# EAGLE design PenMega (EAGLE 6.5.0)
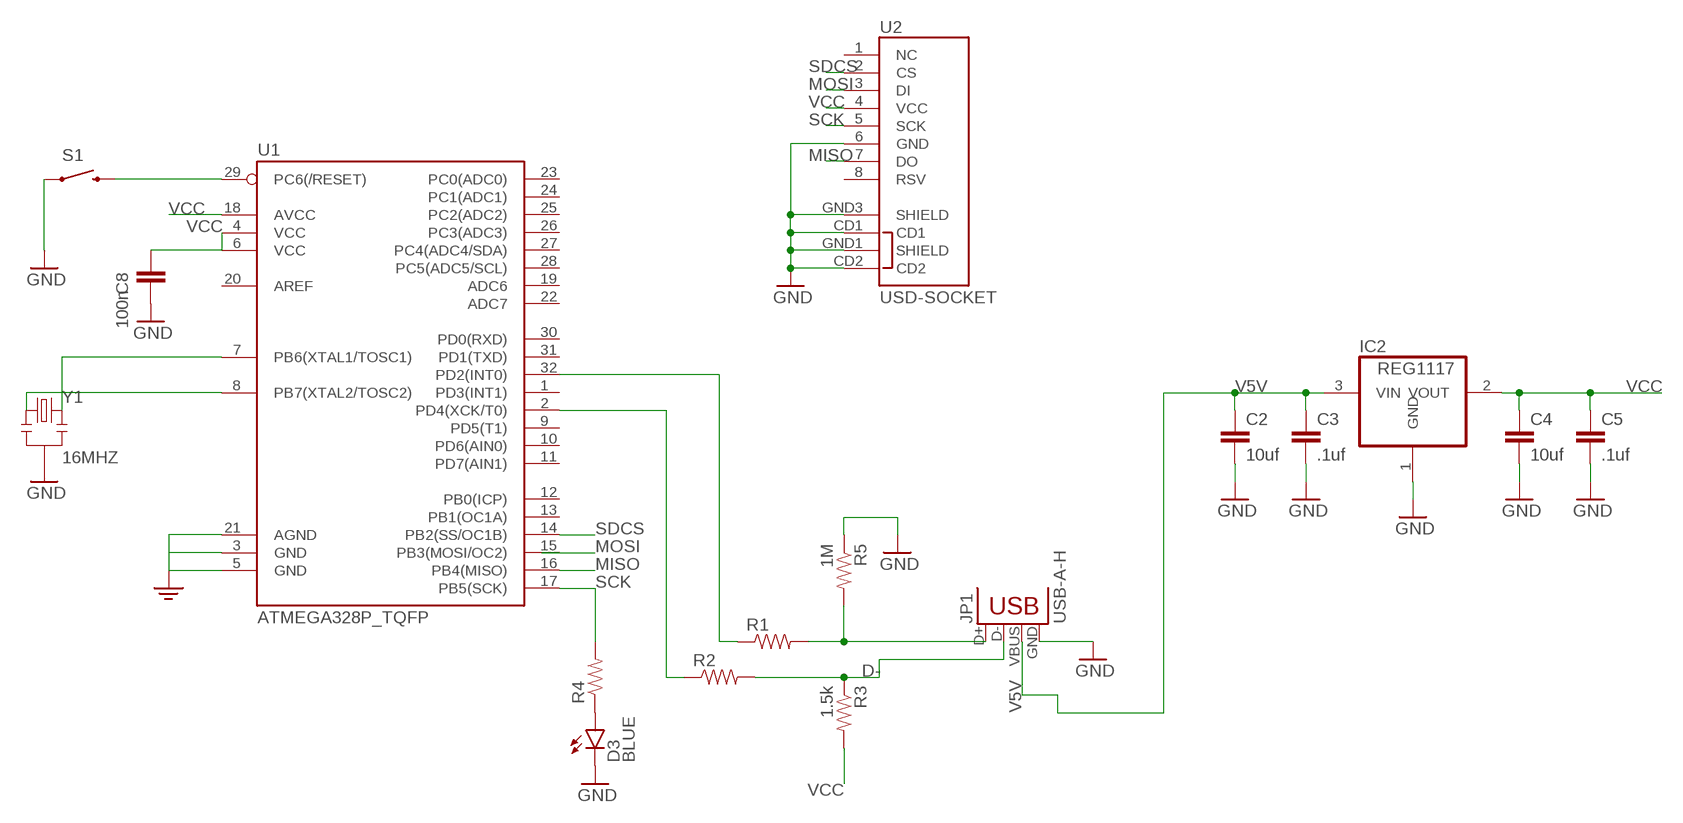
[diagram p0: schematic, sheet 1]

## Parts
C2  10uf  22UF-6.3V-20%(0805)  [0805]
C3  .1uf  CAP0603-CAP  [0603-CAP]
C4  10uf  22UF-6.3V-20%(0805)  [0805]
C5  .1uf  CAP0603-CAP  [0603-CAP]
C8  100n  CAP0603-CAP  [0603-CAP]
D3  BLUE  LED-BLUE0603  [LED-0603]
IC2  REG1117  [SOT223]
JP1  USB-A-H  [USB-A-H]
R1  RESISTOR0603-RES  [0603-RES]
R2  RESISTOR0603-RES  [0603-RES]
R3  1.5k  RESISTOR0603-RES  [0603-RES]
R4  RESISTOR0603-RES  [0603-RES]
R5  1M  RESISTOR0603-RES  [0603-RES]
S1  SWITCH-MOMENTARY-2SMD  [TACTILE-SWITCH-SMD]
U1  ATMEGA328P_TQFP  [TQFP32-08]
U2  USD-SOCKET  [MICROSD_1:1]
Y1  16MHZ  RESONATOR16MHZ  [RESONATOR-SMD]

## Nets
D-: JP1.D- R2.2 R3.1
GND: C2.2 C3.2 C4.2 C5.2 C8.2 D3.C IC2.1(GND) JP1.GND R5.1 S1.1 U1.3(GND) U1.5(GND) U1.21(AGND) U2.6(GND) U2.CD1 U2.CD2 U2.GND1(SHIELD) U2.GND3(SHIELD) Y1.2 ; supply symbol labelled GND2
MISO: U1.16(PB4(MISO)) U2.7(DO)
MOSI: U2.3(DI)
N$1: U1.8(PB7(XTAL2/TOSC2)) Y1.1
N$2: U1.7(PB6(XTAL1/TOSC1)) Y1.3
N$3: JP1.D+ R1.2 R5.2
N$5: R2.1 U1.2(PD4(XCK/T0))
N$6: R1.1 U1.32(PD2(INT0))
N$7: S1.3 U1.29(PC6(/RESET))
N$12: D3.A R4.1
SCK: R4.2 U1.17(PB5(SCK)) U2.5(SCK)
SDCS: U1.14(PB2(SS/OC1B)) U2.2(CS)
V5V: C2.1 C3.1 IC2.3(VIN) JP1.VBUS
VCC: C4.1 C5.1 C8.1 IC2.2(VOUT) R3.2 U1.4(VCC) U1.6(VCC) U1.18(AVCC) U2.4(VCC)
Unconnected: U1.1(PD3(INT1)) U1.9(PD5(T1)) U1.10(PD6(AIN0)) U1.11(PD7(AIN1)) U1.12(PB0(ICP)) U1.13(PB1(OC1A)) U1.15(PB3(MOSI/OC2)) U1.19(ADC6) U1.20(AREF) U1.22(ADC7) U1.23(PC0(ADC0)) U1.24(PC1(ADC1)) U1.25(PC2(ADC2)) U1.26(PC3(ADC3)) U1.27(PC4(ADC4/SDA)) U1.28(PC5(ADC5/SCL)) U1.30(PD0(RXD)) U1.31(PD1(TXD)) U2.1(NC) U2.8(RSV)

## Library data of the parts
C2 C4 = SparkFun-Capacitors:22UF-6.3V-20%(0805): CAP-08402 Ceramic; PROD_ID: CAP-08402; VALUE: 22uF
C3 C5 C8 = SparkFun-Passives:CAP: Capacitor Standard 0603 ceramic capacitor, and 0.1" leaded capacitor.
D3 = SparkFun-LED:LED-BLUE: Blue LEDs for production use Various blue LEDs stocked by SparkFun production 0603 - DIO-08575 Rebel - DIO-09553 1206 - DIO-09911; PROD_ID: DIO-08575
IC2 = burr-brown:REG1117: 800mA and 1A Low Dropout (LDO) Positive Regulator 1.8V, 2.5V, 2.85V, 3.3V, 5V, and Adj; MPN: REG1117; OC_FARNELL: 1097566; OC_NEWARK: 14P6981
JP1 = SparkFun-Connectors:USB: USB Connectors USB-B-PTH is fully proven SKU : PRT-00139/CONN-08278 USB-miniB is fully proven SKU : PRT-00587 USB-A-PCB is untested. USB-A-H is throughly reviewed, but untested. Spark Fun Electronics SKU : PRT-00437 USB-B-SMT is throughly reviewed, but untested. Needs silkscreen touching up. USB-A-S has not been used/tested USB-MB-H has not been used/tested USB-MICROB has been used. CONN-09505; PROD_ID: CONN-08367
R1-R5 = SparkFun-Passives:RESISTOR: Resistor Basic schematic elements and footprints for 0603, 1206, and PTH resistors.
S1 = SparkFun-Electromechanical:SWITCH-MOMENTARY-2: Various NO switches- pushbuttons, reed, etc; PROD_ID: SWCH-08247
U1 = SparkFun-DigitalIC:ATMEGA328P_TQFP; PROD_ID: IC-09069
U2 = SparkFun-Connectors:USD-SOCKET: microSD Socket Push-push type uSD socket. Schematic element and footprint production proven. Spark Fun Electronics SKU : PRT-00127. tDoc lines correctly indicate media card edge positions when inserting (unlocked, locked, depressed). NOTE: CD1 and CD2 are connected internally; PROD_ID: CONN-07820
Y1 = SparkFun-FreqCtrl_Modified:RESONATOR: Resonator Small SMD resonator. Used, eg, on the Arduino Pro/ Pro Mini boards. 8MHz- XTAL-08895 16MHz- XTAL-08900; PROD_ID: XTAL-08900

## Board
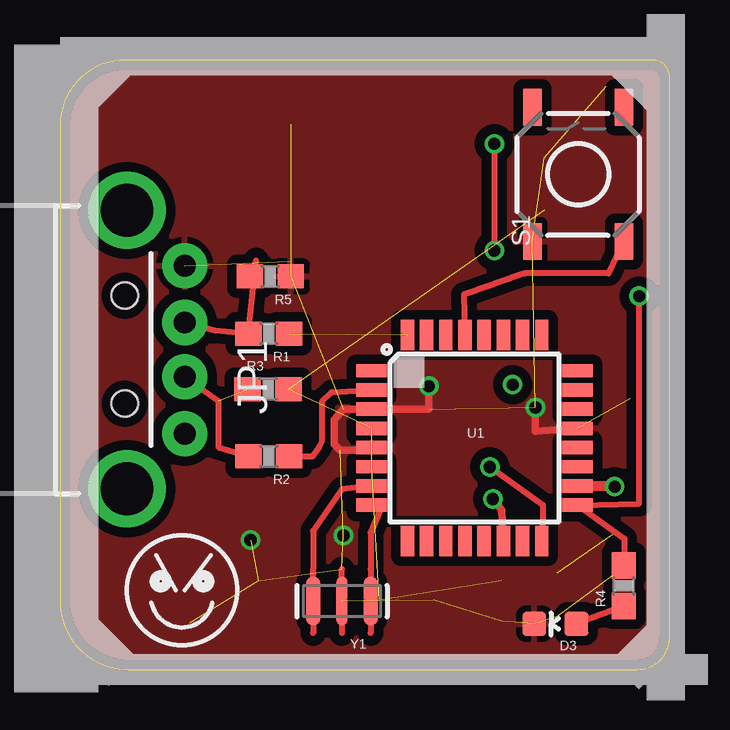
[diagram p1: board, top side]
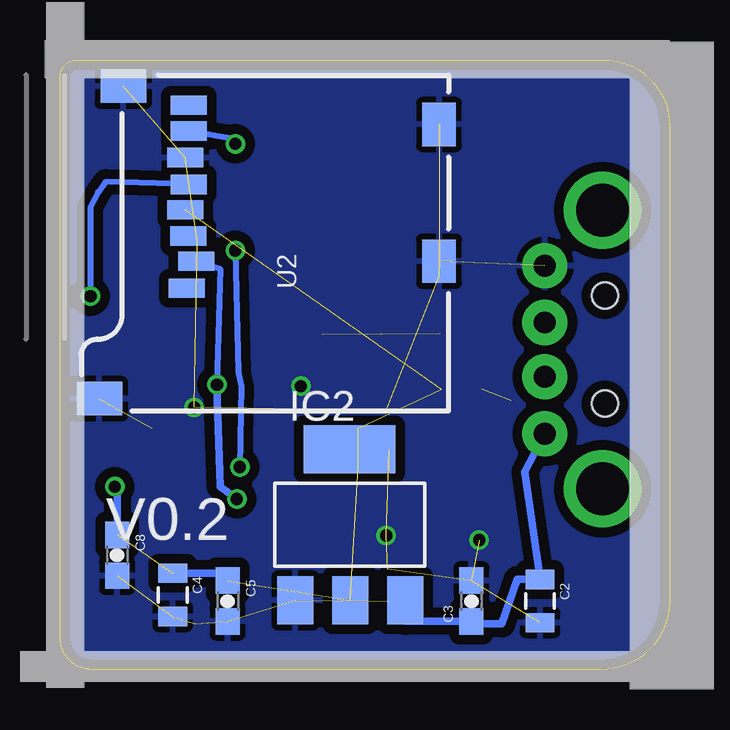
[diagram p2: board, bottom side, seen from below]

Size 25.4 x 25.4 mm. Coordinates in mm from the lower left corner, seen from the top.
Outline: 25.4,1.35 25.4,24.69 arc90 24.69,25.4 2.73,25.4 arc90 0,22.67 0,2.84 arc90 2.84,0 24.05,0 arc90 25.4,1.35
Copper layers (1*16): Top 0.035mm / dielectric 1.5mm / Bottom 0.035mm
Design rules "SeeedStudio_2layer_DRU_no_angle_20140221": minimum track width 6mil, minimum drill 12mil, track to track 6mil, track to pad 6mil, pad to pad 6mil, via to via 6mil, smd to smd 0mil, copper to edge 10mil, drill to drill 10mil, minimum pad ring 10mil, minimum via ring 6mil, stop-mask expansion 2mil, vias tented up to drill 100mil, thermal gap 10mil

### Footprints (pad centres in the part's own frame; a part is rotated, then mirrored left to right if it is on the bottom)
0805 = smd 0.8 x 1.2: 1 -0.9,0; 2 0.9,0
0603-CAP = smd 1.1 x 1: 1 -0.85,0; 2 0.85,0
LED-0603 = smd 1 x 1: A 0,-0.877; C 0,0.877
SOT223 = smd 1.499 x 2.007: 1 -2.261,-3.15; 2 0.025,-3.15; 3 2.311,-3.15 | smd 3.81 x 2.007: 4 0,3.15
USB-A-H = drill 0.914 pad 1.88: D+ 2.4,1.127; D- 2.4,-1.127; GND 2.4,3.5; VBUS 2.4,-3.5 | drill 2.2: GND2 0,-5.8; GND3 0,5.8 | hole 1.1: -0.1,2.25; -0.1,-2.25
0603-RES = smd 1.1 x 1: 1 -0.85,0; 2 0.85,0
TACTILE-SWITCH-SMD = smd 1.524 x 0.762: 1 -2.794,1.905; 2 2.794,1.905; 3 -2.794,-1.905; 4 2.794,-1.905
TQFP32-08 = smd 1.27 x 0.559: 1 -4.293,2.8; 2 -4.293,2; 3 -4.293,1.2; 4 -4.293,0.4; 5 -4.293,-0.4; 6 -4.293,-1.2; 7 -4.293,-2; 8 -4.293,-2.8; 17 4.293,-2.8; 18 4.293,-2; 19 4.293,-1.2; 20 4.293,-0.4; 21 4.293,0.4; 22 4.293,1.2; 23 4.293,2; 24 4.293,2.8 | smd 0.559 x 1.27: 9 -2.8,-4.293; 10 -2,-4.293; 11 -1.2,-4.293; 12 -0.4,-4.293; 13 0.4,-4.293; 14 1.2,-4.293; 15 2,-4.293; 16 2.8,-4.293; 25 2.8,4.293; 26 2,4.293; 27 1.2,4.293; 28 0.4,4.293; 29 -0.4,4.293; 30 -1.2,4.293; 31 -2,4.293; 32 -2.8,4.293
MICROSD_1:1 = smd 0.8 x 1.5: 1 5.096,10.919; 2 6.218,10.519; 3 7.274,10.853; 4 8.367,10.982; 5 9.421,10.828; 6 10.539,10.973; 7 11.648,10.819; 8 12.721,10.819 | smd 1.8 x 1.4: CD1 11.92,0.4; CD2 6.22,0.4 | smd 1.4 x 1.9: GND1 0.497,14.55; GND3 13.52,13.55
RESONATOR-SMD = smd 0.61 x 2.032: 1 -1.2,0; 3 1.2,0 | smd 0.45 x 2.032: 2 0,0

### Placement (x,y rotation side)
C2  5.4,2.86 270 bottom
C3  8.26,2.86 90 bottom
C4  20.7,3.11 270 bottom
C5  18.41,2.86 270 bottom
C8  23.02,4.76 270 bottom
D3  20.64,1.91 90 top
IC2  13.34,6.03 0 bottom
JP1  2.79,13.34 0 top
R1  8.7,14 180 top
R2  8.7,8.89 180 top
R3  8.67,11.68 0 top
R4  23.5,3.49 90 top
R5  8.76,16.38 180 top
S1  21.59,20.64 90 top
U1  17.27,9.65 0 top
U2  9.21,10.79 90 bottom
Y1  11.75,2.86 180 top

### Tracks (layer width: path | path; a pad name or v marks a point on that pad's centre or on a via)
D-  (1 unrouted)
  Top 0.254: JP1.D- 6.6,11.19 6.6,9.27 R2.2
GND  (via drill 0.51)  (19 unrouted)
  Top 0.305: v15.37,11.81 15.37,10.85 U1.3 11.81,10.85 11.43,10.41 11.43,9.4 11.68,9.14 12.98,9.14 U1.5 | U1.21 19.81,9.93 v19.81,10.92
  other vias: 7.94,5.4 11.81,5.59
  pour Bottom (isolate 0.406): 0.32,25.08 25.08,25.08 25.08,0.32 0.32,0.32
  pour Top (isolate 0.406): 0.32,25.08 25.08,25.08 25.08,0.32 0.32,0.32
MISO  (via drill 0.51)
  Top 0.254: U1.16 20.13,6.38 20.13,6.86 v17.91,8.45 | v18.1,21.91 v18.1,17.46
  Bottom 0.254: U2.7 18.1,22.13 v18.1,21.91 | v18.1,17.46 17.97,12.38 17.84,11.81 v17.91,8.45
N$1
  Top 0.254: U1.8 13.34,6.67 12.95,5.71 12.95,4.19
N$2
  Top 0.254: U1.7 11.75,7.53 10.55,5.78 10.55,4.19
N$3
  Top 0.254: R5.2 8.17,17.05 R1.2 6.46,14.13 JP1.D+
N$5
  Top 0.254: 12.76,11.53 U1.2 11.33,11.56 10.92,11.18 10.92,9.53 10.79,9.27 10.54,8.89 R2.1
N$6  (1 unrouted)
N$7
  Top 0.254: S1.3 22.86,16.51 19.37,16.51 16.83,15.62 U1.29
N$12
  Top 0.254: R4.1 D3.A
SCK  (via drill 0.51)
  Top 0.254: R4.2 23.52,5.46 U1.17 24.13,6.92 v24.13,15.56
  Bottom 0.254: U2.5 23.5,20.32 23.81,19.9 24.13,19.26 v24.13,15.56
SDCS  (via drill 0.51)
  Top 0.305: U1.14 18.41,6.63 v18.03,7.11
  Bottom 0.254: U2.2 18.73,16.7 v18.86,11.87
  Bottom 0.305: v18.03,7.11 18.73,7.62 v18.86,11.87
V5V
  Bottom 0.254: 11.02,2.01 IC2.3 | 8.26,1.91 C3.1
  Bottom 0.305: JP1.VBUS 6.03,8.25 C2.1 6.35,3.76 6.99,1.91 8.26,1.91 | C3.1 11.02,2.01
VCC  (via drill 0.51)  (6 unrouted)
  Top 0.406: U1.18 23.11,7.65 v23.11,7.62
  Bottom 0.305: C4.1 18.41,4.01 C5.1 | v23.11,7.62 23.02,7.62 C8.1

### Text on the board
bPlace: V0.2